# EasyEDA schematic SCH_motorcontroller_2025-02-14.json
TITLE: Sheet_1; REV: 1.0; Date: 2025-02-14; Sheet: 1/1; Company: Jan Golak
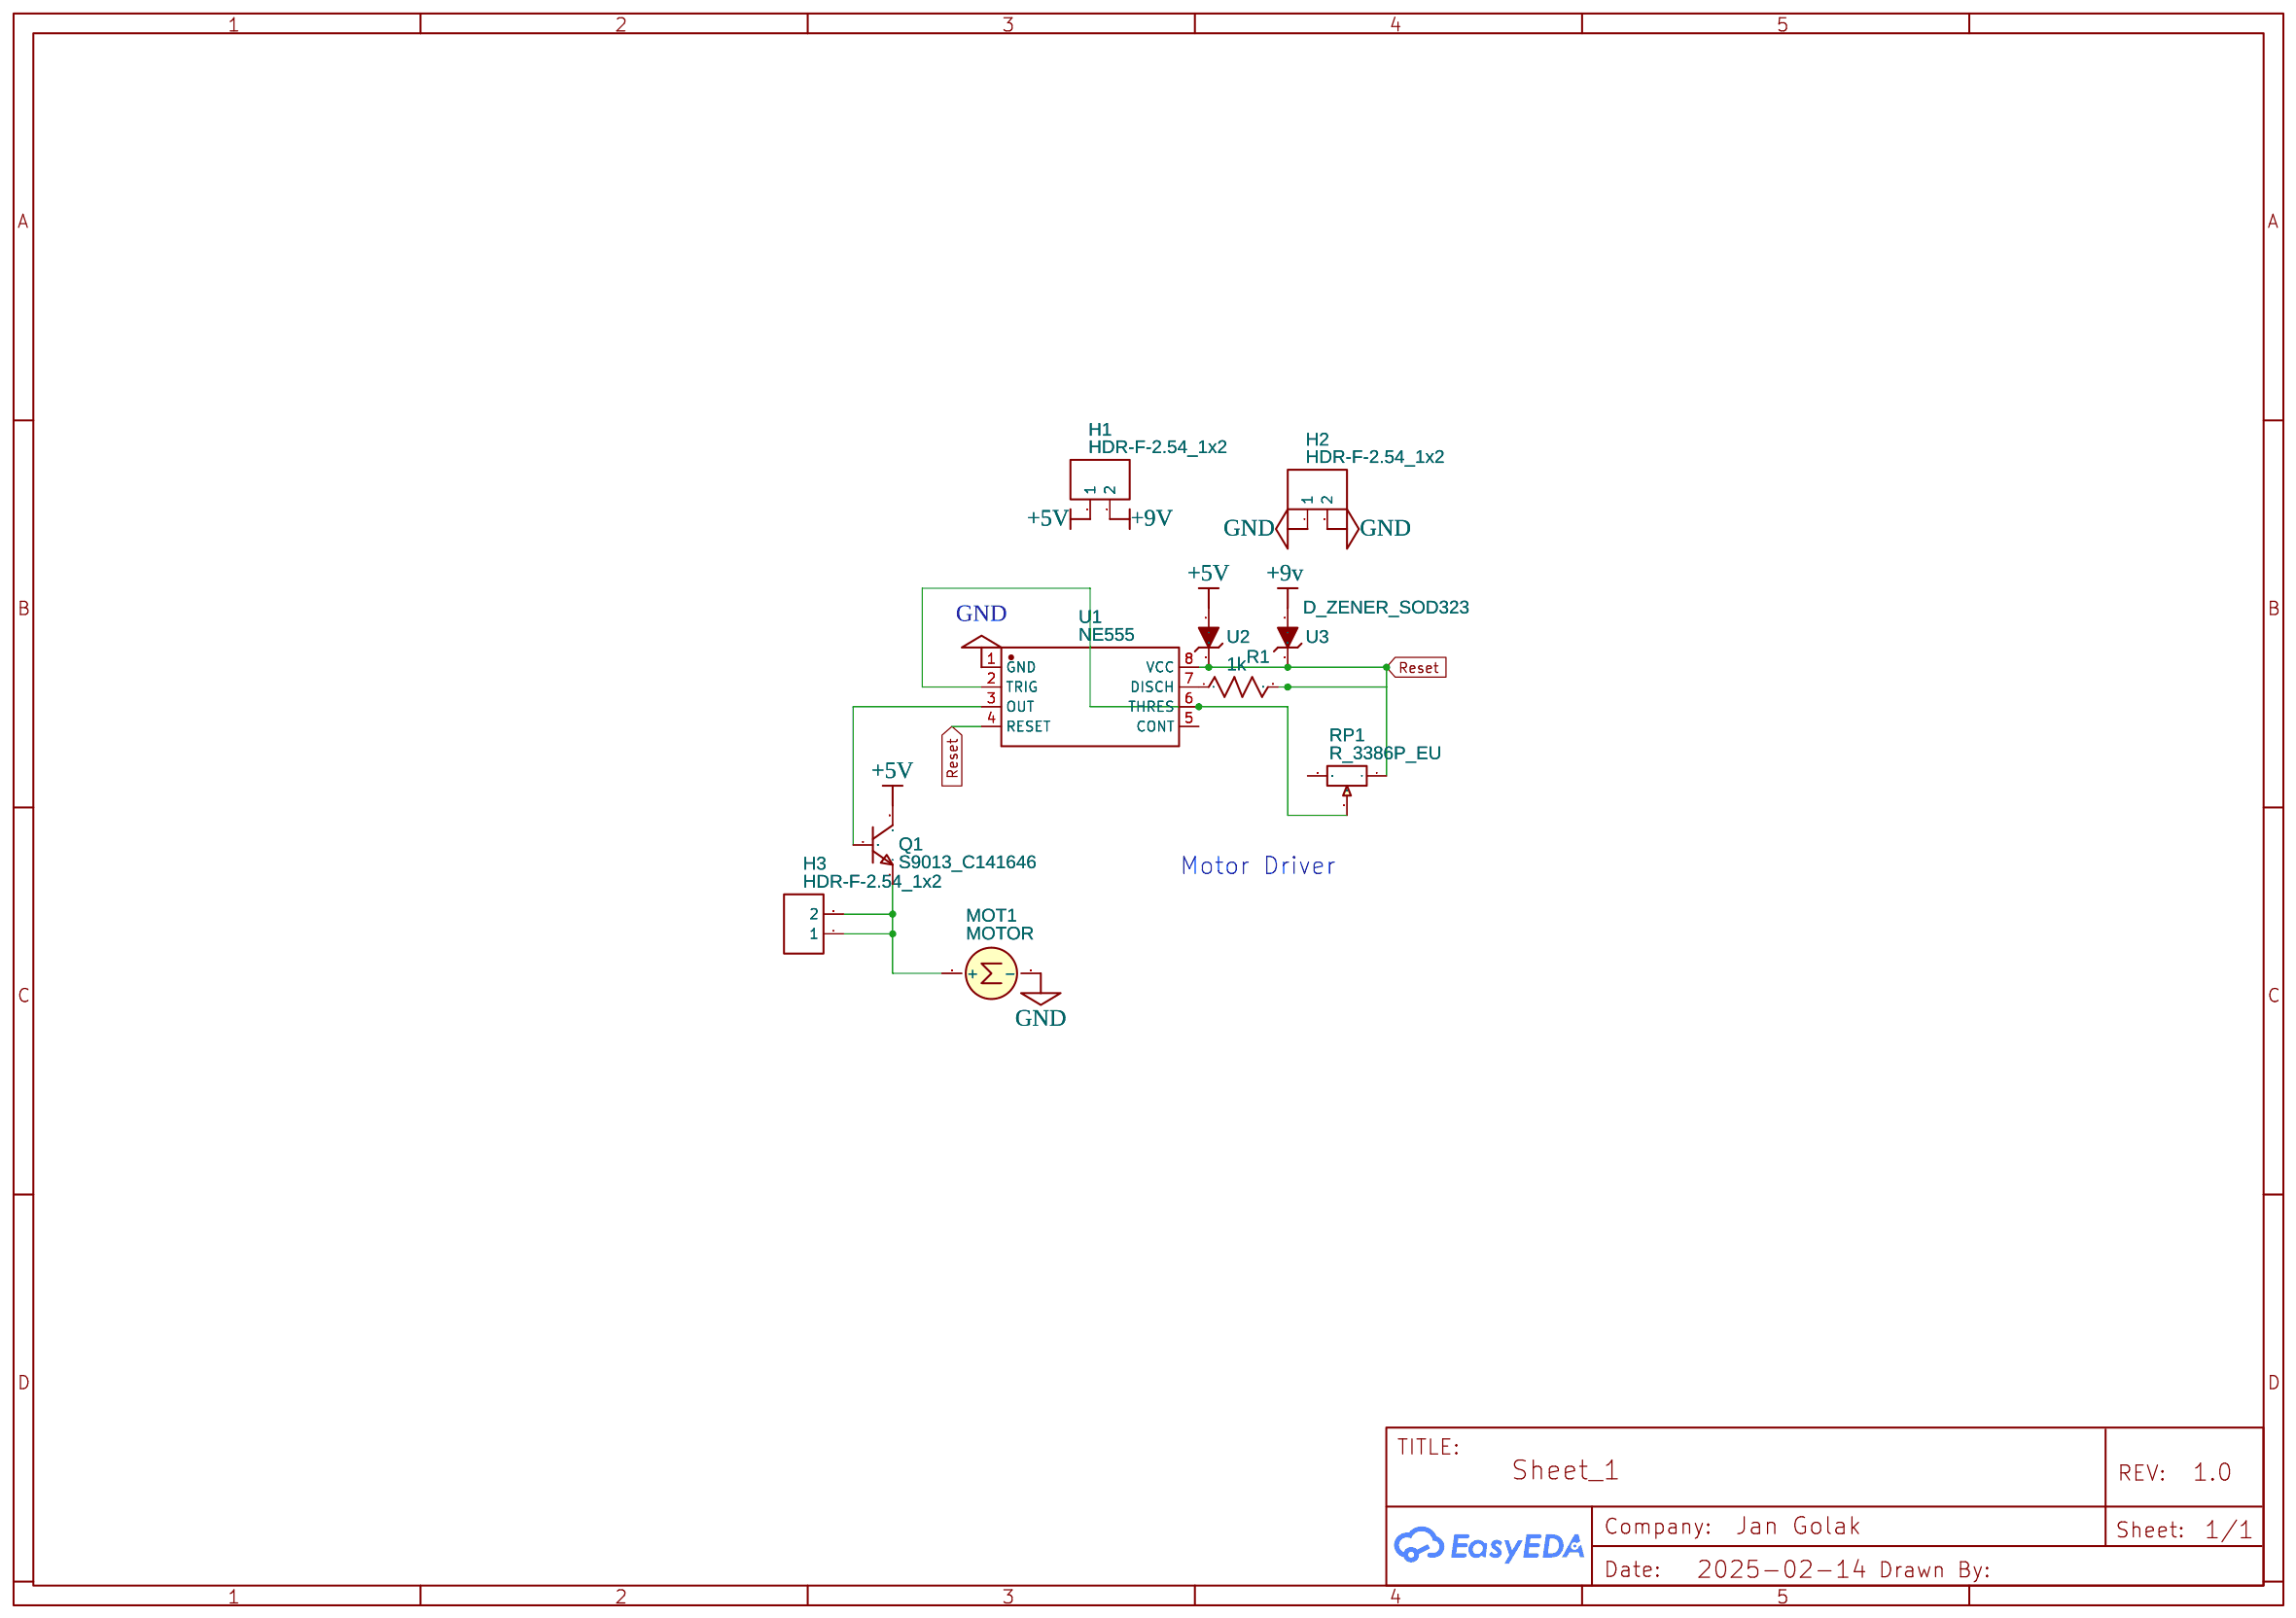
[diagram p0: schematic sheet]

## Parts
H1  HDR-F-2.54_1x2  [HDR-F-2.54_1X2]
H2  HDR-F-2.54_1x2  [HDR-F-2.54_1X2]
H3  HDR-F-2.54_1x2  [HDR-F-2.54_1X2]
MOT1  MOTOR  [VIBRATION MOTOR - 3V COIN TYPE VIBRATION MOTOR 10000RPM]
Q1  S9013_C141646  [TO-92-3_L4.9-W3.7-P1.27-L]
R1  1k  [R0603]
RP1  R_3386P_EU  [RES-ADJ-TH_3386P]
U1  NE555  [SOP-8_L5.0-W4.0-P1.27-LS6.0-BL]
U2  D_ZENER_SOD323  [SOD-323_L1.6-W1.2-LS2.6-RD]
U3  D_ZENER_SOD323  [SOD-323_L1.6-W1.2-LS2.6-RD]

## Library data of the parts
H1-H3 = HDR-F-2.54_1x2: Supplier Part: C49661; Supplier: LCSC; Contributor: LCEDA_Lib
MOT1 = motor 24v: Supplier: LCSC; Supplier Part: C2759984; Manufacturer: LEADER(立得); Manufacturer Part: LCM1027A2445F; JLCPCB Part Class: Extended Part; Contributor: a188132
Q1 = S9013_C141646: Contributor: LCSC; Supplier: LCSC; Supplier Part: C141646; Manufacturer: Changjiang Electronics Tech (CJ); Manufacturer Part: S9013
R1 = R_0603_US: Contributor: LCEDA_Lib
RP1 = R_3386P_EU: Supplier: LCSC; Contributor: LCEDA_Lib; Value(Ω): 10K
U1 = NE555: Contributor: LCSC; Supplier: LCSC; Supplier Part: C504549; Manufacturer: null; JLCPCB Part Class: Extended Part
U2 U3 = D_ZENER_SOD323: Contributor: LCSC; Supplier: LCSC; Supplier Part: C2929304; Manufacturer: null; Manufacturer Part: D_Zener_SOD323; JLCPCB Part Class: Extended Part

## Nets
+5V: H1.1 Q1.3(C) U2.2(A)
+9v: U3.2(A)
+9V: H1.2
GND: H2.1 H2.2 MOT1.1(-) U1.1(GND)
Reset: R1.2 RP1.1 U1.4(RESET) U1.8(VCC) U2.1(C) U3.1(C)
Net-(H3-1): H3.1 H3.2 MOT1.2(+) Q1.1(E)
Net-(Q1-2): Q1.2(B) U1.3(OUT)
Net-(R1-1): R1.1 U1.7(DISCH)
Net-(RP1-2): RP1.2 U1.2(TRIG) U1.6(THRES)

Not connected (* = marked no-connect by the designer): RP1 3; U1 5(CONT)

## Notes on the sheet
- Motor Driver
